# EAGLE design master (EAGLE 5.06)
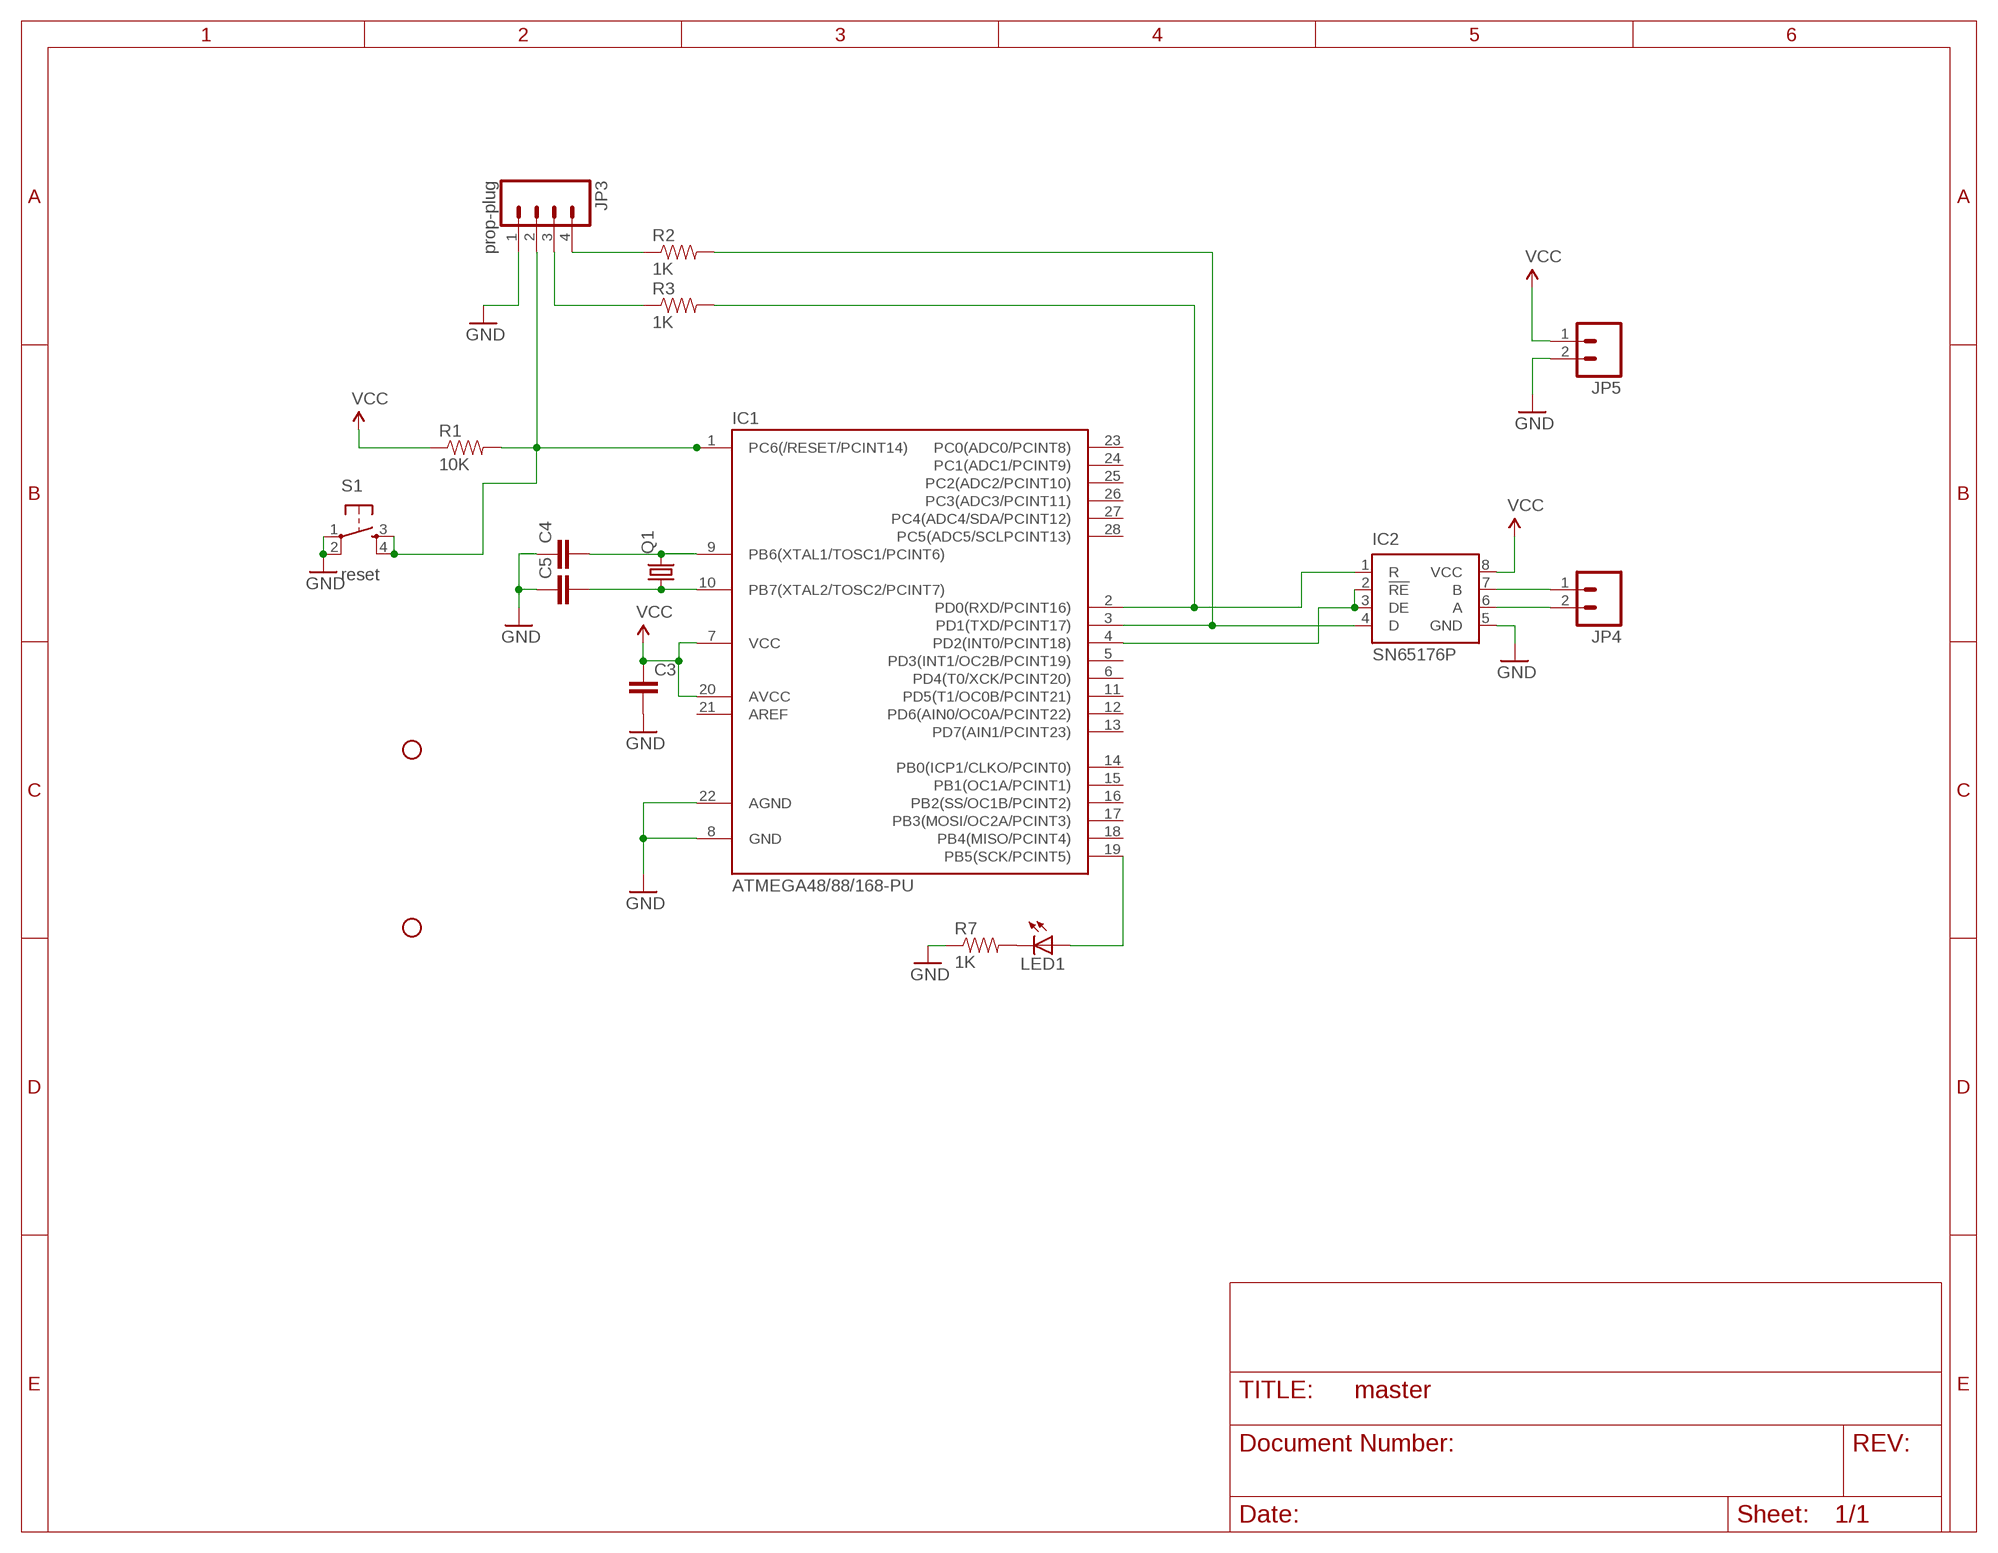
[diagram p0: schematic, sheet 1]

## Parts
C3  CAPPTH  [CAP-PTH-SMALL]
C4  CAPPTH  [CAP-PTH-SMALL]
C5  CAPPTH  [CAP-PTH-SMALL]
IC1  ATMEGA48/88/168-PU  [DIL28-3]
IC2  SN65176P  [DIL08]
JP3  prop-plug  M04PTH  [1X04]
JP4  M02PTH  [1X02]
JP5  M02PTH  [1X02]
JP9  STAND-OFF  [STAND-OFF]
JP10  STAND-OFF  [STAND-OFF]
LED1  LED5MM  [LED5MM]
Q1  CRYSTALHC49U-V  [HC49U-V]
R1  10K  RESISTORPTH1  [AXIAL-0.3]
R2  1K  RESISTORPTH1  [AXIAL-0.3]
R3  1K  RESISTORPTH1  [AXIAL-0.3]
R7  1K  RESISTORPTH1  [AXIAL-0.3]
S1  reset  TAC_SWITCHPTH  [TACTILE-PTH]

## Nets
GND: C3.2 C4.1 C5.1 IC1.8(GND) IC1.22(AGND) IC2.5(GND) JP3.1 JP5.2 R7.P$1 S1.1 S1.2
N$1: C4.2 IC1.9(PB6(XTAL1/TOSC1/PCINT6)) Q1.2
N$2: C5.2 IC1.10(PB7(XTAL2/TOSC2/PCINT7)) Q1.1
N$3: IC1.4(PD2(INT0/PCINT18)) IC2.2(!RE) IC2.3(DE)
N$7: JP3.3 R3.P$1
N$9: IC1.1(PC6(/RESET/PCINT14)) JP3.2 R1.P$2 S1.3 S1.4
N$11: IC2.7(B) JP4.1
N$12: JP3.4 R2.P$1
N$13: IC1.3(PD1(TXD/PCINT17)) IC2.4(D) R2.P$2
N$14: IC2.6(A) JP4.2
N$15: IC1.2(PD0(RXD/PCINT16)) IC2.1(R) R3.P$2
N$21: LED1.K(C) R7.P$2
N$24: IC1.19(PB5(SCK/PCINT5)) LED1.A
VCC: C3.1 IC1.7(VCC) IC1.20(AVCC) IC2.8(VCC) JP5.1 R1.P$1
Unconnected: IC1.5(PD3(INT1/OC2B/PCINT19)) IC1.6(PD4(T0/XCK/PCINT20)) IC1.11(PD5(T1/OC0B/PCINT21)) IC1.12(PD6(AIN0/OC0A/PCINT22)) IC1.13(PD7(AIN1/PCINT23)) IC1.14(PB0(ICP1/CLKO/PCINT0)) IC1.15(PB1(OC1A/PCINT1)) IC1.16(PB2(SS/OC1B/PCINT2)) IC1.17(PB3(MOSI/OC2A/PCINT3)) IC1.18(PB4(MISO/PCINT4)) IC1.21(AREF) IC1.23(PC0(ADC0/PCINT8)) IC1.24(PC1(ADC1/PCINT9)) IC1.25(PC2(ADC2/PCINT10)) IC1.26(PC3(ADC3/PCINT11)) IC1.27(PC4(ADC4/SDA/PCINT12)) IC1.28(PC5(ADC5/SCLPCINT13))

## Library data of the parts
C3-C5 = SparkFun:CAP: Capacitor Standard 0603 ceramic capacitor, and 0.1" leaded capacitor.
IC1 = atmega8:ATMEGA48/88/168-PU
IC2 = texas:SN65176: DIFFERENTIAL BUS TRANSCEIVER Source: http://focus.ti.com .. sn65176b.pdf
JP3 = SparkFun:M04: Header 4 Standard 4-pin 0.1" header. Use with straight break away headers (SKU : PRT-00116), right angle break away headers (PRT-00553), swiss pins (PRT-00743), machine pins (PRT-00117), and female headers (PRT-00115). Molex polarized connector foot print use with SKU : PRT-08231 with associated crimp pins and housings.
JP4 JP5 = SparkFun:M02: Header 2 Standard 2-pin 0.1" header. Use with straight break away headers (SKU : PRT-00116), right angle break away headers (PRT-00553), swiss pins (PRT-00743), machine pins (PRT-00117), and female headers (PRT-00115). Molex polarized connector foot print use with SKU : PRT-08233 with associated crimp pins and housings.
JP9 JP10 = SparkFun:STAND-OFF: Stand Off This is the mechanical footprint for a #4 phillips button head screw. Use the keepout ring to avoid running the screw head into surrounding components. SKU : PRT-00447
LED1 = SparkFun:LED: LEDs Standard schematic elements and footprints for 5mm, 3mm, 1206, and 0603 sized LEDs. 5mm - Spark Fun Electronics SKU : COM-00529 (and others)
Q1 = crystal:CRYSTAL: CRYSTAL
R1-R3 R7 = SparkFun:RESISTOR: Resistor Basic schematic elements and footprints for 0603, 1206, and PTH 1/10th watt (small) resistors.
S1 = SparkFun:TAC_SWITCH: Momentary Switch Button commonly used for reset or general input. Spark Fun Electronics SKU : COM-00097

## Net classes
0 signal: width 0.381 mm, drill 0.813 mm, clearance 0.254 mm
1 drive: width 1.778 mm, drill 0.813 mm, clearance 0.254 mm

## Board
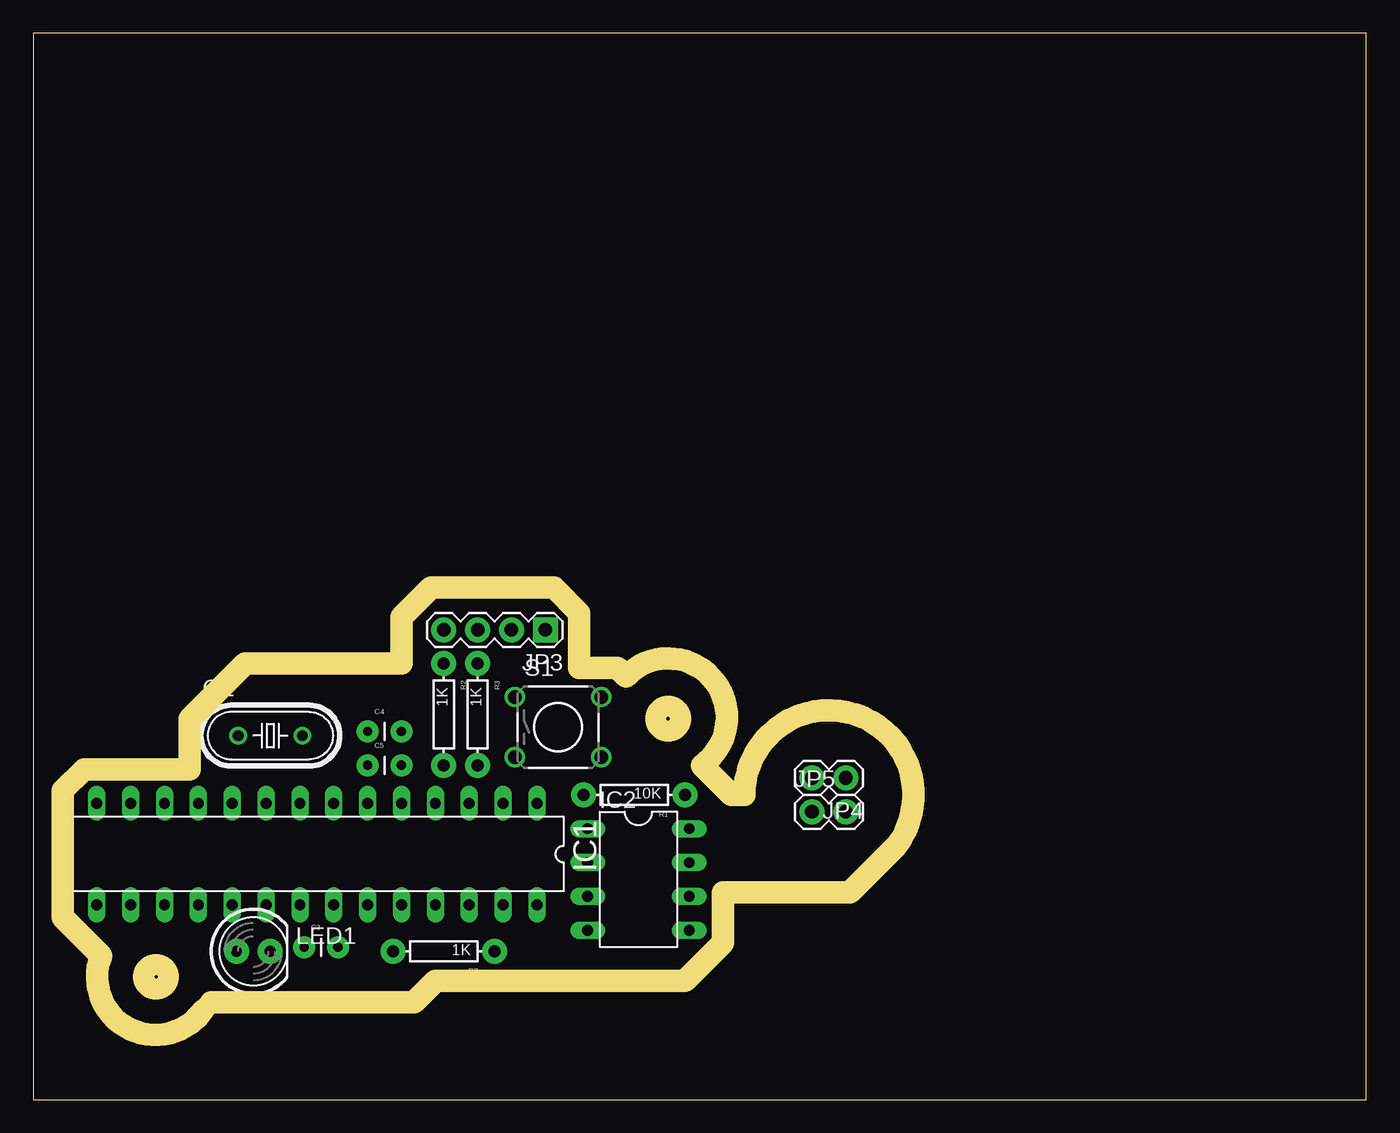
[diagram p1: board, top side]
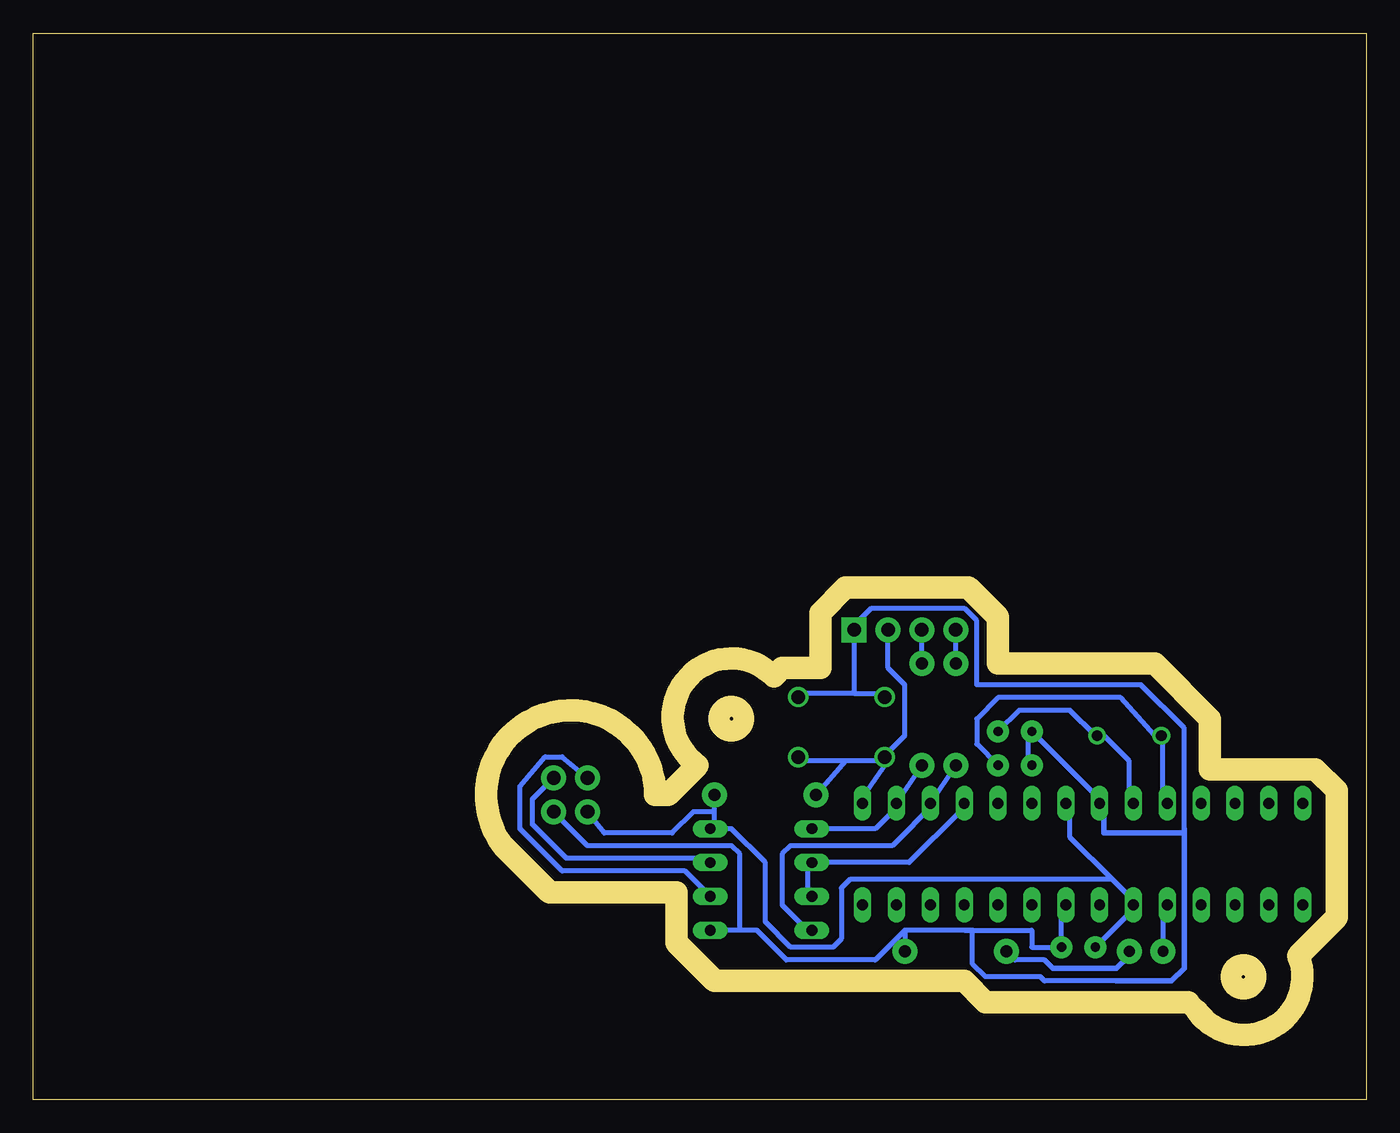
[diagram p2: board, bottom side, seen from below]

Size 100 x 80 mm. Coordinates in mm from the lower left corner, seen from the top.
Outline: 0,0 100,0 100,80 0,80 0,0
Copper layers (1*16): Top 0.035mm / dielectric 1.5mm / Bottom 0.035mm
Design rules "default *": minimum track width 15mil, minimum drill 24mil, track to track 15mil, track to pad 15mil, pad to pad 8mil, via to via 8mil, smd to smd 8mil, copper to edge 63mil, drill to drill 8mil, minimum pad ring 10mil, minimum via ring 8mil, stop-mask expansion 4mil, vias tented up to drill 0mil, thermal gap 10mil
Milling: area 46.7,27.7 to 48.5,29.5; area 8.3,8.3 to 10.1,10.1; 28 lines

### Footprints (pad centres in the part's own frame; a part is rotated, then mirrored left to right if it is on the bottom)
CAP-PTH-SMALL = drill 0.7 pad 1.651 round: 1 0,0; 2 2.54,0
DIL28-3 = drill 0.813 long: 1 -16.51,-3.81; 2 -13.97,-3.81; 3 -11.43,-3.81; 4 -8.89,-3.81; 5 -6.35,-3.81; 6 -3.81,-3.81; 7 -1.27,-3.81; 8 1.27,-3.81; 9 3.81,-3.81; 10 6.35,-3.81; 11 8.89,-3.81; 12 11.43,-3.81; 13 13.97,-3.81; 14 16.51,-3.81; 15 16.51,3.81; 16 13.97,3.81; 17 11.43,3.81; 18 8.89,3.81; 19 6.35,3.81; 20 3.81,3.81; 21 1.27,3.81; 22 -1.27,3.81; 23 -3.81,3.81; 24 -6.35,3.81; 25 -8.89,3.81; 26 -11.43,3.81; 27 -13.97,3.81; 28 -16.51,3.81
DIL08 = drill 0.813 long: 1 -3.81,-3.81; 2 -1.27,-3.81; 3 1.27,-3.81; 4 3.81,-3.81; 5 3.81,3.81; 6 1.27,3.81; 7 -1.27,3.81; 8 -3.81,3.81
1X04 = drill 1.016 pad 1.88 square: 1 0,0 | drill 1.016 pad 1.88 round: 2 2.54,0; 3 5.08,0; 4 7.62,0
1X02 = drill 1.016 pad 1.88 round: 1 0,0; 2 2.54,0
STAND-OFF = hole 3.302: 0,0
LED5MM = drill 0.813 pad 1.88 round: A -1.27,0; K 1.27,0
HC49U-V = drill 0.813 round: 1 -2.413,0; 2 2.413,0
AXIAL-0.3 = drill 0.9 pad 1.88 round: P$1 -3.81,0; P$2 3.81,0
TACTILE-PTH = drill 1.016 round: 1 -3.251,2.261; 2 3.251,2.261; 3 -3.251,-2.261; 4 3.251,-2.261

### Placement (x,y rotation side)
C3  20.32,11.43 0 top
C4  25.08,27.62 0 top
C5  25.08,25.08 0 top
IC1  21.27,18.41 180 top
IC2  45.4,16.51 270 top
JP3  38.42,35.24 180 top
JP4  60.96,24.13 180 top
JP5  58.42,21.59 0 top
JP9  9.21,9.21 0 top
JP10  47.62,28.57 0 top
LED1  16.51,11.11 0 top
Q1  17.78,27.3 0 top
R1  45.09,22.86 180 top
R2  30.8,28.89 270 top
R3  33.34,28.89 270 top
R7  30.8,11.11 180 top
S1  39.37,27.94 0 top

### Tracks (layer width: path | path; a pad name or v marks a point on that pad's centre or on a via)
GND
  Bottom 0.381: 38.42,30.48 42.23,30.48 S1.2 | 38.42,30.48 36.51,30.48 S1.1 | 38.42,30.48 JP3.1 38.42,35.56 37.15,36.83 30.11,36.83 29.21,35.93 29.21,31.11 16.89,31.11 13.65,27.88 13.65,20.32 | C5.1 25.4,25.4 25.4,27.3 C4.1 20.32,22.86 20.32,22.23 IC1.8 19.68,22.23 19.68,21.59 | IC1.22 22.86,14.61 C3.2 25.08,11.43 25.08,12.7 30.16,12.7 | 46.99,12.7 45.72,12.7 43.5,10.48 36.83,10.48 34.61,12.7 | 46.99,12.7 IC2.5 | JP5.2 58.42,19.05 47.62,19.05 46.99,18.41 46.99,12.7 | 30.16,12.7 34.61,12.7 | 34.61,12.7 R7.P$1 | 18.73,8.89 24.13,8.89 24.45,9.21 28.57,9.21 29.53,10.16 29.53,12.7 30.16,12.7
  Bottom 0.406: 19.68,21.59 19.68,20 13.65,20 13.65,20.32 13.65,9.84 14.61,8.89 18.73,8.89
N$1
  Bottom 0.381: IC1.9 17.78,22.23 17.78,25.4 19.68,27.3 Q1.2 20.32,27.3 22.23,29.21 26.04,29.21 C4.2
N$2
  Bottom 0.381: IC1.10 15.24,22.23 15.24,27.3 Q1.1 15.88,27.3 18.41,30.16 27.62,30.16 29.21,28.57 29.21,26.67 C5.2
N$3
  Bottom 0.381: IC1.4 30.48,22.23 30.48,21.59 34.29,17.78 IC2.2 41.91,17.78 41.91,15.24 IC2.3
N$7
  Bottom 0.381: R3.P$1 JP3.3
N$9
  Bottom 0.381: IC1.1 38.1,22.23 35.88,25.4 S1.3 | 39.05,25.4 36.51,25.4 S1.3 | 39.05,25.4 42.23,25.4 S1.4 | JP3.2 35.88,32.38 34.61,31.11 34.61,27.3 35.88,26.04 S1.3 | 39.05,25.4 R1.P$2
N$11
  Bottom 0.381: JP4.1 62.55,22.54 62.55,20.64 60.01,18.1 49.53,18.1 IC2.7
N$12
  Bottom 0.381: R2.P$1 JP3.4
N$13
  Bottom 0.381: R2.P$2 IC1.3 32.38,22.23 35.56,19.05 43.18,19.05 43.81,18.41 43.81,14.61 41.91,12.7 IC2.4
N$14
  Bottom 0.381: JP4.2 60.33,25.72 61.59,25.72 63.5,23.5 63.5,20.32 60.33,17.14 51.12,17.14 IC2.6
N$15
  Bottom 0.381: R3.P$2 IC1.2 34.92,22.23 36.83,20.32 IC2.1
N$21
  Bottom 0.381: 23.5,9.84 24.13,10.48 26.35,10.48 R7.P$2
  Bottom 0.406: LED1.K 17.78,10.79 18.73,9.84 23.5,9.84
N$24
  Bottom 0.381: LED1.A 15.24,14.61 IC1.19
VCC
  Bottom 0.381: 48.9,21.59 R1.P$1 | 48.9,20.32 48.9,21.59 | 48.9,21.59 50.48,21.59 52.07,20 57.15,20 JP5.1 | C3.1 17.78,13.97 17.78,14.61 IC1.20 17.14,14.61 19.05,16.51 | 19.05,16.51 22.23,19.68 22.23,22.23 IC1.7 | 48.9,20.32 47.62,20.32 45.09,17.78 45.09,13.34 43.18,11.43 40.01,11.43 39.37,12.06 39.37,15.88 38.73,16.51 19.05,16.51 | 48.9,20.32 IC2.8